# Altium schematic sheet TFT_Adapter_Board.SchDoc
size A4
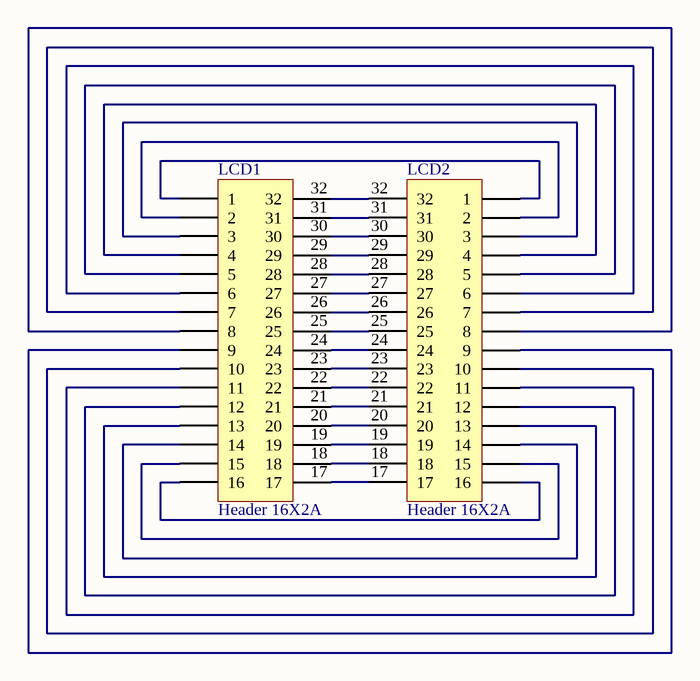
[diagram p0: TFT_Adapter_Board.SchDoc]

## Parts
LCD1  Header 16X2A  [HDR2X16_CEN]
LCD2  Header 16X2A  [HDR2X16_CEN]

## Nets
NetLCD1_1: LCD1.1 LCD2.1
NetLCD1_2: LCD1.2 LCD2.2
NetLCD1_3: LCD1.3 LCD2.3
NetLCD1_4: LCD1.4 LCD2.4
NetLCD1_5: LCD1.5 LCD2.5
NetLCD1_6: LCD1.6 LCD2.6
NetLCD1_7: LCD1.7 LCD2.7
NetLCD1_8: LCD1.8 LCD2.8
NetLCD1_9: LCD1.9 LCD2.9
NetLCD1_10: LCD1.10 LCD2.10
NetLCD1_11: LCD1.11 LCD2.11
NetLCD1_12: LCD1.12 LCD2.12
NetLCD1_13: LCD1.13 LCD2.13
NetLCD1_14: LCD1.14 LCD2.14
NetLCD1_15: LCD1.15 LCD2.15
NetLCD1_16: LCD1.16 LCD2.16
NetLCD1_17: LCD1.17 LCD2.17
NetLCD1_18: LCD1.18 LCD2.18
NetLCD1_19: LCD1.19 LCD2.19
NetLCD1_20: LCD1.20 LCD2.20
NetLCD1_21: LCD1.21 LCD2.21
NetLCD1_22: LCD1.22 LCD2.22
NetLCD1_23: LCD1.23 LCD2.23
NetLCD1_24: LCD1.24 LCD2.24
NetLCD1_25: LCD1.25 LCD2.25
NetLCD1_26: LCD1.26 LCD2.26
NetLCD1_27: LCD1.27 LCD2.27
NetLCD1_28: LCD1.28 LCD2.28
NetLCD1_29: LCD1.29 LCD2.29
NetLCD1_30: LCD1.30 LCD2.30
NetLCD1_31: LCD1.31 LCD2.31
NetLCD1_32: LCD1.32 LCD2.32

## Library data of the parts
LCD1 LCD2 = Header 16X2A: Header, 16-Pin, Dual row; LatestRevisionDate: 17-Jul-2002; LatestRevisionNote: Re-released for DXP Platform.; Publisher: Altium Limited